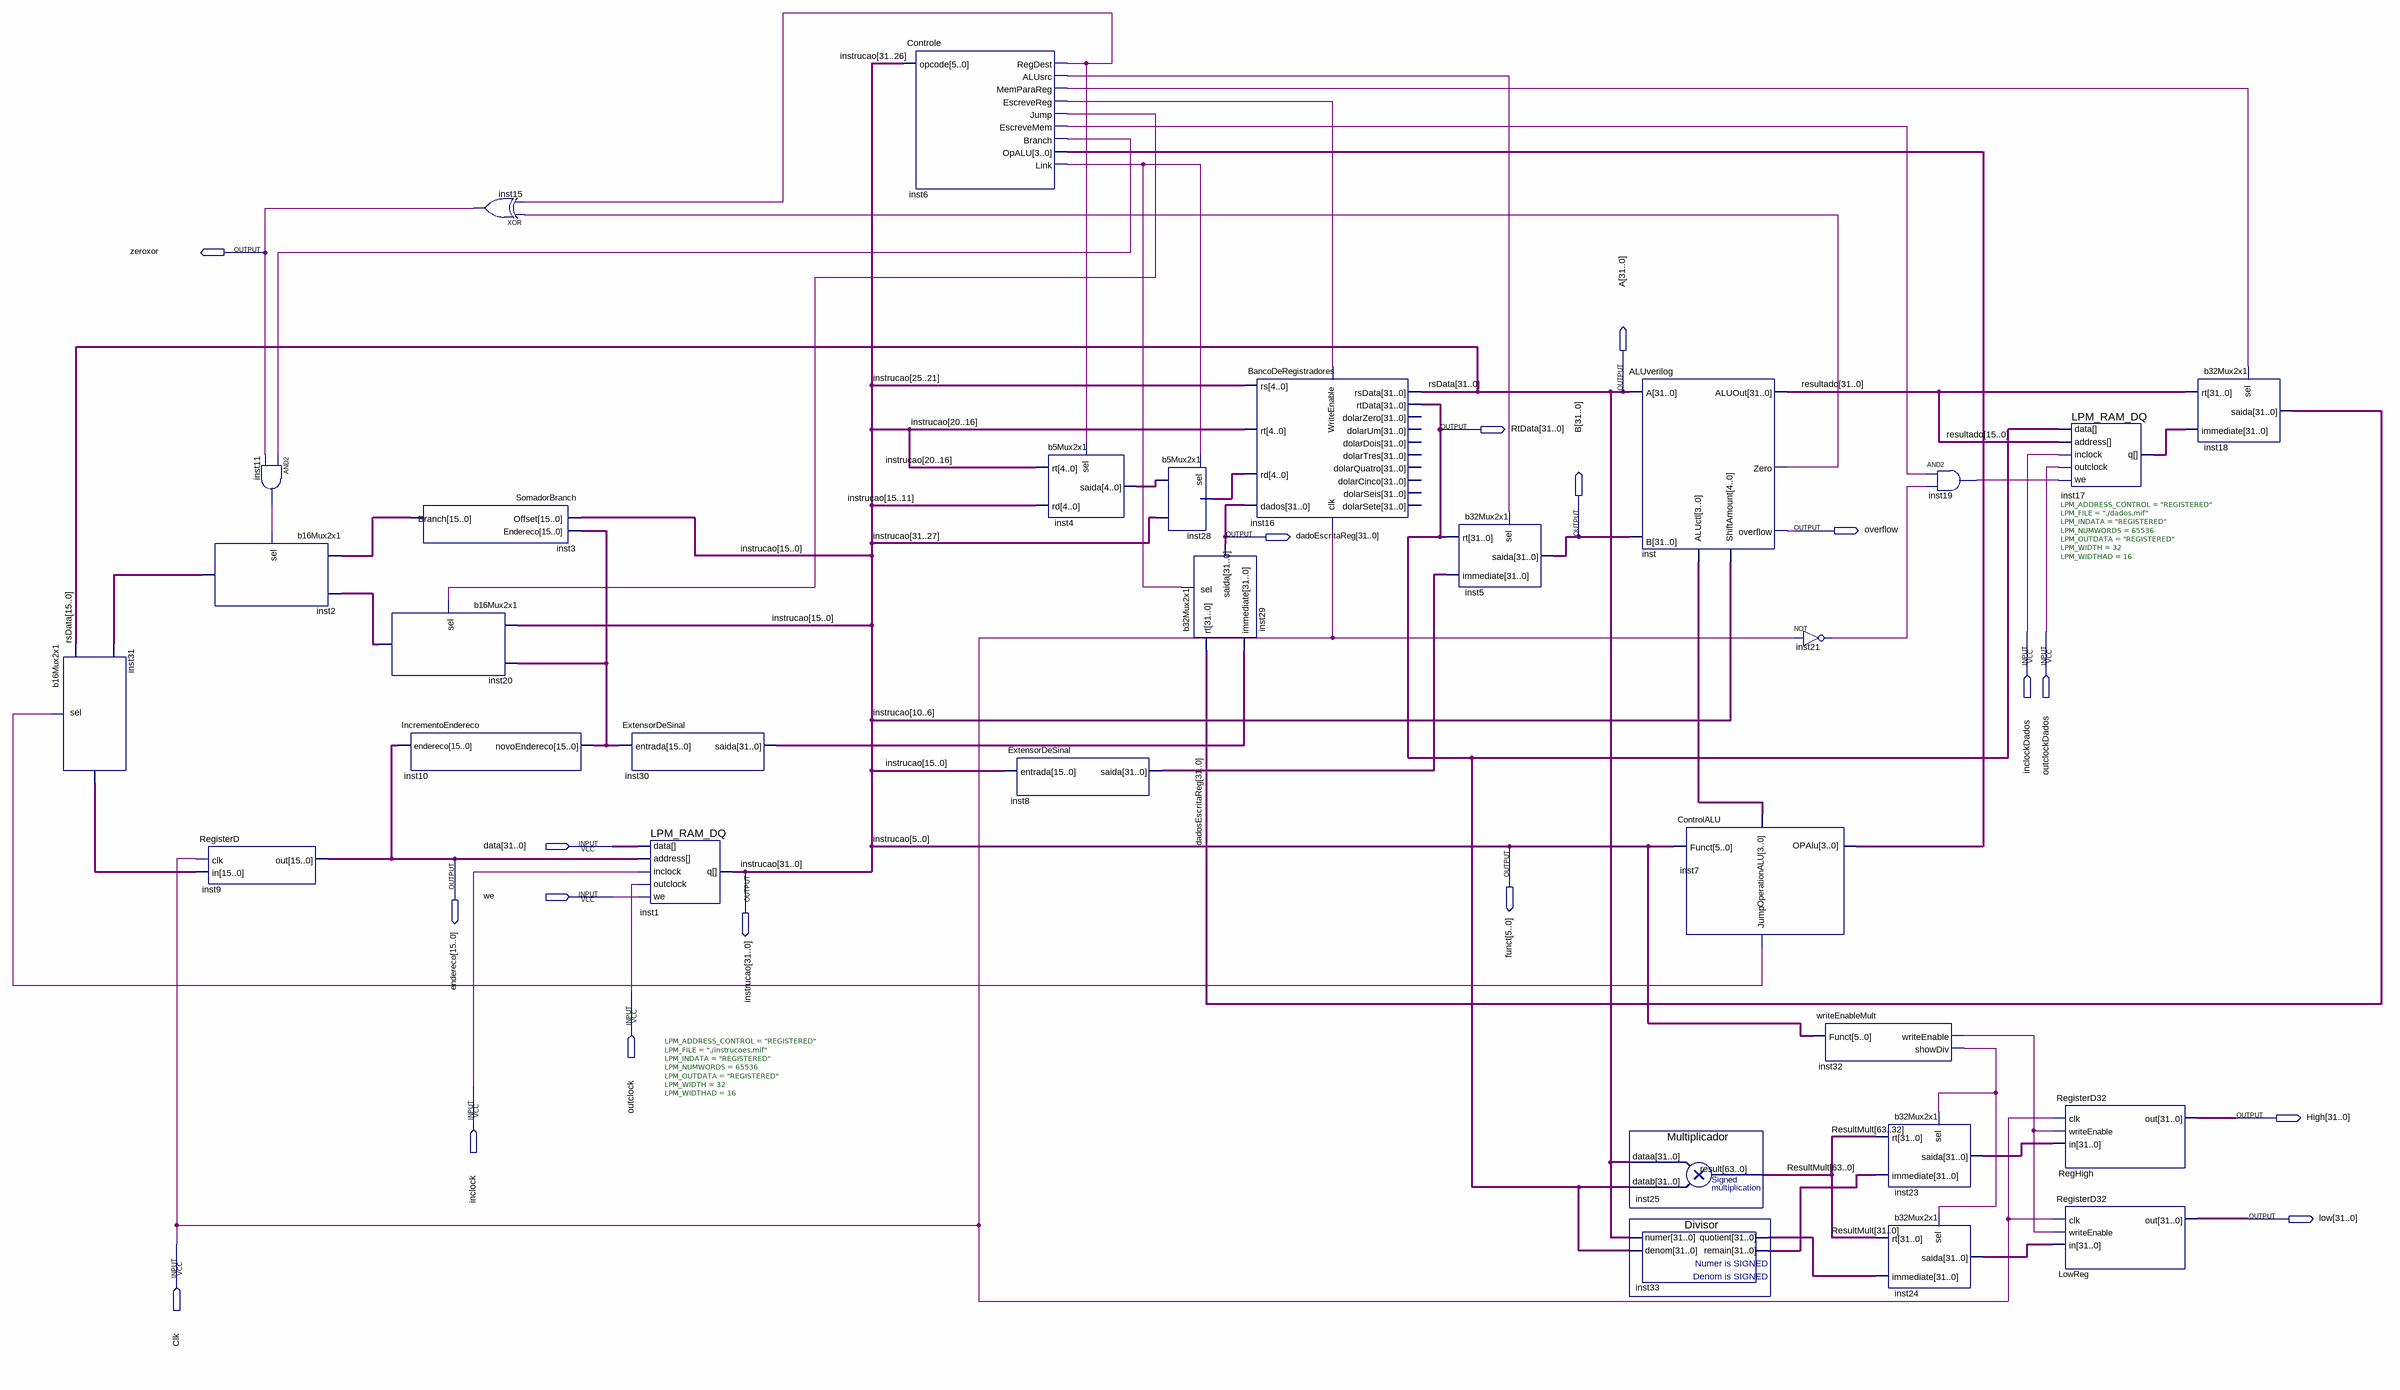
[diagram p0: schematic sheet]
// Quartus schematic testeUlamaisControleULA.bdf as structural Verilog: 30 symbols, 18 pins
module testeUlamaisControleULA (
  input  inclockDados,
  input  outclockDados,
  input  [31:0] data,
  input  we,
  input  outclock,
  input  inclock,
  input  Clk,
  output zeroxor,
  output [31:0] A,
  output [31:0] RtData,
  output overflow,
  output [31:0] dadoEscritaReg,
  output [31:0] B,
  output [5:0] funct,
  output [15:0] endereco,
  output [31:0] instrucao,
  output [31:0] High,
  output [31:0] low
);

  wire inst6_alusrc, inst6_branch, inst6_escrevemem, inst6_escrevereg, inst6_jump, inst6_link,
       inst6_memparareg, inst6_regdest, inst7_jump, inst11_out, inst19_out, inst21_out, inst32_showdiv,
       inst32_writeenable, inst_zero;
  wire [3:0] inst6_opalu, inst7_operationalu;
  wire [4:0] inst4_saida, inst28_saida;
  wire [15:0] inst2_endereco, inst3_branch, inst10_novoendereco, inst20_endereco, inst31_endereco;
  wire [31:0] dadosEscritaReg, inst8_saida, inst17_q, inst23_saida, inst24_saida, inst30_saida,
       inst33_quotient, inst33_remain, resultado;
  wire [63:0] ResultMult;

  b16Mux2x1 inst31 (.sel(inst7_jump), .Branch(A[15:0]), .Pc(inst2_endereco), .Endereco(inst31_endereco));
  b16Mux2x1 inst2 (.sel(inst11_out), .Branch(inst3_branch), .Pc(inst20_endereco), .Endereco(inst2_endereco));
  RegisterD inst9 (.clk(Clk), .in(inst31_endereco), .out(endereco));
  and inst11 (inst11_out, inst6_branch, zeroxor);
  SomadorBranch inst3 (.Offset({instrucao[15:6], funct}), .Endereco(inst10_novoendereco), .Branch(inst3_branch));
  b16Mux2x1 inst20 (
    .sel(inst6_jump), .Branch({instrucao[15:6], funct}), .Pc(inst10_novoendereco), .Endereco(inst20_endereco));
  IncrementoEndereco inst10 (.endereco(endereco), .novoEndereco(inst10_novoendereco));
  xor inst15 (zeroxor, inst_zero, inst6_regdest);
  ExtensorDeSinal inst30 (.entrada(inst10_novoendereco), .saida(inst30_saida));
  LPM_RAM_DQ #(.LPM_ADDRESS_CONTROL("REGISTERED"), .LPM_FILE("./instrucoes.mif"), .LPM_INDATA("REGISTERED"), .LPM_NUMWORDS(65536), .LPM_OUTDATA("REGISTERED"), .LPM_WIDTH(32), .LPM_WIDTHAD(16)) inst1 (
    .inclock(inclock), .data(data), .address(endereco), .we(we), .outclock(outclock),
    .q({instrucao[31:6], funct}));
  Controle inst6 (
    .opcode(instrucao[31:26]), .RegDest(inst6_regdest), .ALUsrc(inst6_alusrc), .MemParaReg(inst6_memparareg),
    .EscreveReg(inst6_escrevereg), .Jump(inst6_jump), .EscreveMem(inst6_escrevemem), .Branch(inst6_branch),
    .OpALU(inst6_opalu), .Link(inst6_link));
  ExtensorDeSinal inst8 (.entrada({instrucao[15:6], funct}), .saida(inst8_saida));
  b5Mux2x1 inst4 (.rt(instrucao[20:16]), .rd(instrucao[15:11]), .sel(inst6_regdest), .saida(inst4_saida));
  b5Mux2x1 inst28 (.sel(inst6_link), .rt(inst4_saida), .rd(instrucao[31:27]), .saida(inst28_saida));
  b32Mux2x1 inst29 (.rt(dadosEscritaReg), .immediate(inst30_saida), .sel(inst6_link), .saida(dadoEscritaReg));
  BancoDeRegistradores inst16 (
    .clk(Clk), .dados(dadoEscritaReg), .rs(instrucao[25:21]), .rt(instrucao[20:16]), .rd(inst28_saida),
    .WriteEnable(inst6_escrevereg), .rsData(A), .rtData(RtData));  // open: dolarZero, dolarUm, dolarDois, dolarTres, dolarQuatro, dolarCinco, dolarSeis, dolarSete
  b32Mux2x1 inst5 (.rt(RtData), .immediate(inst8_saida), .sel(inst6_alusrc), .saida(B));
  ALUverilog inst (
    .ALUctl(inst7_operationalu), .A(A), .B(B), .ShiftAmount(instrucao[10:6]), .ALUOut(resultado),
    .Zero(inst_zero), .overflow(overflow));
  Multiplicador inst25 (.dataa(A), .datab(RtData), .result(ResultMult));
  Divisor inst33 (.numer(A), .denom(RtData), .quotient(inst33_quotient), .remain(inst33_remain));
  ControlALU inst7 (.OPAlu(inst6_opalu), .Funct(funct), .OperationALU(inst7_operationalu), .Jump(inst7_jump));
  not inst21 (inst21_out, Clk);
  writeEnableMult inst32 (.Funct(funct), .writeEnable(inst32_writeenable), .showDiv(inst32_showdiv));
  b32Mux2x1 inst23 (.rt(ResultMult[63:32]), .immediate(inst33_remain), .sel(inst32_showdiv), .saida(inst23_saida));
  b32Mux2x1 inst24 (.rt(ResultMult[31:0]), .immediate(inst33_quotient), .sel(inst32_showdiv), .saida(inst24_saida));
  and inst19 (inst19_out, inst6_escrevemem, inst21_out);
  LPM_RAM_DQ #(.LPM_ADDRESS_CONTROL("REGISTERED"), .LPM_FILE("./dados.mif"), .LPM_INDATA("REGISTERED"), .LPM_NUMWORDS(65536), .LPM_OUTDATA("REGISTERED"), .LPM_WIDTH(32), .LPM_WIDTHAD(16)) inst17 (
    .inclock(inclockDados), .data(RtData), .address(resultado[15:0]), .we(inst19_out),
    .outclock(outclockDados), .q(inst17_q));
  RegisterD32 RegHigh (.clk(Clk), .writeEnable(inst32_writeenable), .in(inst23_saida), .out(High));
  RegisterD32 LowReg (.clk(Clk), .writeEnable(inst32_writeenable), .in(inst24_saida), .out(low));
  b32Mux2x1 inst18 (.rt(resultado), .immediate(inst17_q), .sel(inst6_memparareg), .saida(dadosEscritaReg));

  assign instrucao[5:0] = funct;

  // Other names for the same wires on the sheet: rsData[31:0] = A
endmodule
